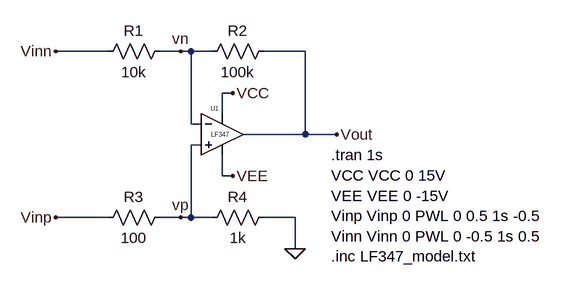
[diagram p0: schematic Differential Amplifier.asc]
Differential Amplifier.asc, the LTspice schematic file:
Version 4
SHEET 1 1504 680
WIRE 272 48 192 48
WIRE 384 48 352 48
WIRE 400 48 384 48
WIRE 432 48 400 48
WIRE 576 48 512 48
WIRE 464 112 448 112
WIRE 448 144 448 112
WIRE 400 160 400 48
WIRE 416 160 400 160
WIRE 576 176 576 48
WIRE 576 176 480 176
WIRE 624 176 576 176
WIRE 416 192 400 192
WIRE 448 240 448 208
WIRE 464 240 448 240
WIRE 272 304 192 304
WIRE 384 304 352 304
WIRE 400 304 400 192
WIRE 400 304 384 304
WIRE 432 304 400 304
WIRE 560 304 512 304
WIRE 560 352 560 304
FLAG 560 352 0
FLAG 464 112 VCC
FLAG 464 240 VEE
FLAG 192 48 Vinn
FLAG 192 304 Vinp
FLAG 624 176 Vout
FLAG 384 304 vp
FLAG 384 48 vn
SYMBOL res 256 64 R270
WINDOW 0 32 56 VTop 2
WINDOW 3 0 56 VBottom 2
SYMATTR InstName R1
SYMATTR Value 10k
SYMBOL res 416 64 R270
WINDOW 0 32 56 VTop 2
WINDOW 3 0 56 VBottom 2
SYMATTR InstName R2
SYMATTR Value 100k
SYMBOL res 256 320 R270
WINDOW 0 32 56 VTop 2
WINDOW 3 0 56 VBottom 2
SYMATTR InstName R3
SYMATTR Value 100
SYMBOL res 416 320 R270
WINDOW 0 32 56 VTop 2
WINDOW 3 0 56 VBottom 2
SYMATTR InstName R4
SYMATTR Value 1k
SYMBOL Opamps/opamp2 448 112 R0
WINDOW 0 -18 24 Left 0
WINDOW 3 -17 86 Invisible 0
WINDOW 38 -17 64 Left 0
SYMATTR InstName U1
SYMATTR Value ""
SYMATTR SpiceModel LF347
TEXT 616 208 Left 2 !.tran 1s\nVCC VCC 0 15V\nVEE VEE 0 -15V\nVinp Vinp 0 PWL 0 0.5 1s -0.5\nVinn Vinn 0 PWL 0 -0.5 1s 0.5\n.inc LF347_model.txt

The netlist it stands for:
* Differential Amplifier.asc
R1 Vinn vn 10k
R2 vn Vout 100k
R3 Vinp vp 100
R4 vp 0 1k
XU1 vp vn VCC VEE Vout LF347  ; pins In+ In- V+ V- OUT
.tran 1s
VCC VCC 0 15V
VEE VEE 0 -15V
Vinp Vinp 0 PWL 0 0.5 1s -0.5
Vinn Vinn 0 PWL 0 -0.5 1s 0.5
.inc LF347_model.txt
.backanno
.end